# EAGLE design Bridge_DS2482 (EAGLE 6.3)
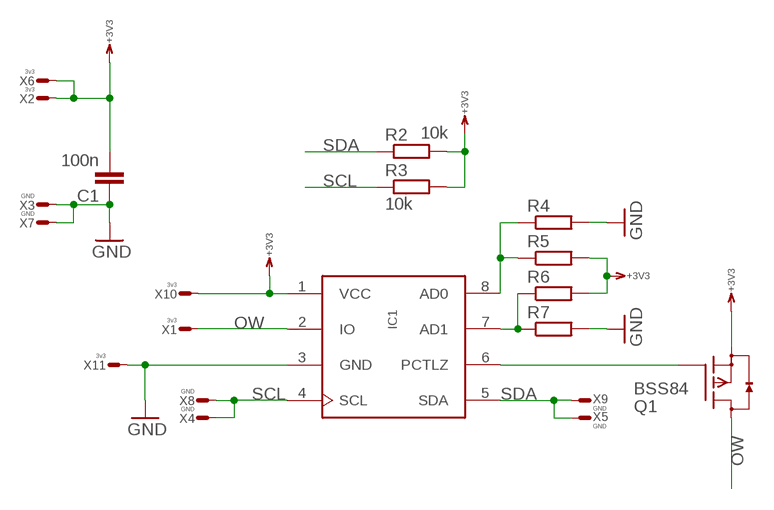
[diagram p0: schematic, sheet 1]

## Parts
C1  100n  C0603  [0603]
IC1  DS2482S  [SO8]
Q1  BSS84  FET-PDSOT23  [SOT23]
R2  10k  R0603  [0603]
R3  10k  R0603  [0603]
R4  R0603  [0603]
R5  R0603  [0603]
R6  R0603  [0603]
R7  R0603  [0603]
X1  3v3  WIREPADT1.6/0.9  [T1.6/0.9]
X2  3v3  WIREPADT1.6/0.9  [T1.6/0.9]
X3  GND  WIREPADT1.6/0.9  [T1.6/0.9]
X4  GND  WIREPADT1.6/0.9  [T1.6/0.9]
X5  GND  WIREPADT1.6/0.9  [T1.6/0.9]
X6  3v3  WIREPADT1.6/0.9  [T1.6/0.9]
X7  GND  WIREPADT1.6/0.9  [T1.6/0.9]
X8  GND  WIREPADT1.6/0.9  [T1.6/0.9]
X9  GND  WIREPADT1.6/0.9  [T1.6/0.9]
X10  3v3  WIREPADT1.6/0.9  [T1.6/0.9]
X11  3v3  WIREPADT1.6/0.9  [T1.6/0.9]

## Nets
+3V3: C1.2 IC1.1(VCC) Q1.2(S) R2.2 R3.2 R5.2 R6.2 X2.1(S) X6.1(S) X10.1(S)
GND: C1.1 IC1.3(GND) R4.2 R7.2 X3.1(S) X7.1(S) X11.1(S)
N$1: IC1.7(AD1) R6.1 R7.1
N$2: IC1.8(AD0) R4.1 R5.1
N$4: IC1.6(PCTLZ) Q1.1(G)
OW: IC1.2(IO) Q1.3(D) X1.1(S)
SCL: IC1.4(SCL) R3.1 X4.1(S) X8.1(S)
SDA: IC1.5(SDA) R2.1 X5.1(S) X9.1(S)

## Library data of the parts
C1 = RCL:C: Capacitor SMD
IC1 = maxim:DS2482
Q1 = Transistor:FET-PD
R2-R7 = RCL:R: Resistor SMD
X1-X11 = Conn:WIREPAD: Wire PAD connect wire on PCB

## Board
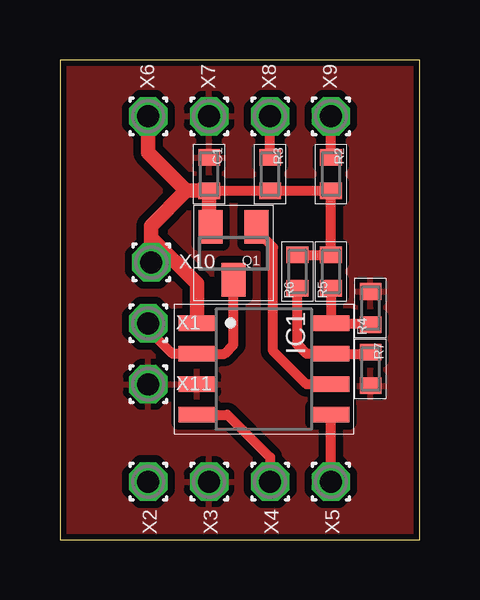
[diagram p1: board, top side]
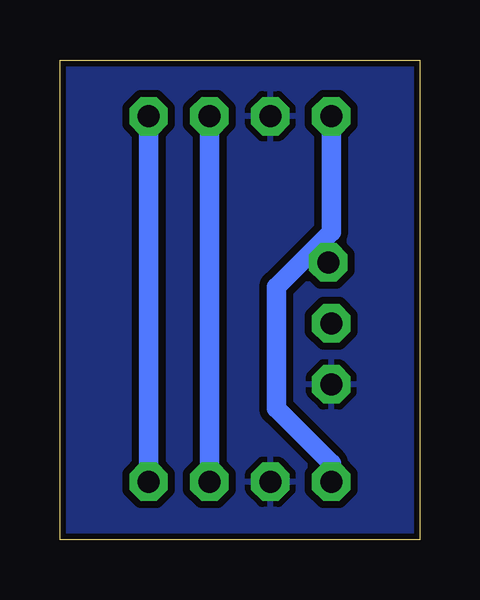
[diagram p2: board, bottom side, seen from below]

Size 15 x 20 mm. Coordinates in mm from the lower left corner, seen from the top.
Outline: 0,0 15,0 15,20 0,20 0,0
Copper layers (1*16): Top 0.035mm / dielectric 1.5mm / Bottom 0.035mm
Design rules "default": minimum track width 10mil, minimum drill 12mil, track to track 12mil, track to pad 12mil, pad to pad 12mil, via to via 12mil, smd to smd 12mil, copper to edge 10mil, drill to drill 8mil, minimum pad ring 10mil, minimum via ring 8mil, stop-mask expansion 4mil, vias tented up to drill 0mil, thermal gap 10mil

### Footprints (pad centres in the part's own frame; a part is rotated, then mirrored left to right if it is on the bottom)
0603 = smd 0.7 x 0.9: 1 -0.697,0; 2 0.697,0
SO8 = smd 0.635 x 1.524: 1 0,-2.794; 2 1.27,-2.794; 3 2.54,-2.794; 4 3.81,-2.794; 5 3.81,2.794; 6 2.54,2.794; 7 1.27,2.794; 8 0,2.794
SOT23 = smd 1 x 1.4: 1 -0.95,-1.1; 2 0.95,-1.1; 3 0,1.1
T1.6/0.9 = drill 0.914 pad 1.6 octagon: 1 0,0

### Placement (x,y rotation side)
C1  6.22,15.24 270 top
IC1  8.51,9.02 270 top
Q1  7.24,11.94 180 top
R2  11.3,15.24 270 top
R3  8.76,15.24 270 top
R4  12.95,9.65 90 top
R5  11.3,11.18 90 top
R6  9.91,11.18 90 top
R7  12.95,7.11 270 top
X1  3.68,9.02 0 top
X2  3.68,2.41 270 top
X3  6.22,2.41 270 top
X4  8.76,2.41 270 top
X5  11.3,2.41 270 top
X6  3.68,17.65 90 top
X7  6.22,17.65 90 top
X8  8.76,17.65 90 top
X9  11.3,17.65 90 top
X10  3.81,11.56 0 top
X11  3.68,6.48 0 top

### Tracks (layer width: path | path; a pad name or v marks a point on that pad's centre or on a via)
+3V3
  Top 0.406: C1.2 R3.2 R2.2 R5.2 R6.2
  Top 0.61: 5.27,14.54 C1.2 6.22,13.1 Q1.2 6.22,12.97 6.22,12.83 | 5.27,14.54 3.68,16.13 X6.1 | X10.1 3.81,12.57 | 3.81,12.57 3.81,13.08 5.27,14.54 | IC1.1 5.71,10.67 3.81,12.57
  Bottom 0.813: X2.1 3.68,3.17 5.97,5.46 5.97,10.54 3.68,12.83 X6.1
GND
  pour Top: 0,20 15,20 15,0 0,0
  pour Bottom: 0,0 15,0 15,20 0,20
N$1
  Top 0.406: R6.1 9.91,8.13 10.29,7.75 IC1.7 12.89,7.75 R7.1
N$2
  Top 0.406: R4.1 12.89,9.02 IC1.8 R5.1
N$4
  Top 0.406: IC1.6 10.29,6.48 8.89,7.87 8.89,12.19 8.26,12.83 8.26,12.97 Q1.1
OW
  Top 0.406: Q1.3 7.24,8.13 6.86,7.75 IC1.2 4.7,7.75 3.68,8.76 X1.1
SCL
  Top 0.406: R3.1 X8.1 | IC1.4 6.99,5.21 8.76,3.43 X4.1
  Bottom 0.813: X8.1 X4.1
SDA
  Top 0.406: R2.1 X9.1 | X5.1 IC1.5
  Bottom 0.813: X9.1 X5.1